# Altium schematic sheet Piezo.SchDoc
size A4; SheetNumber: 4; SheetTotal: 4
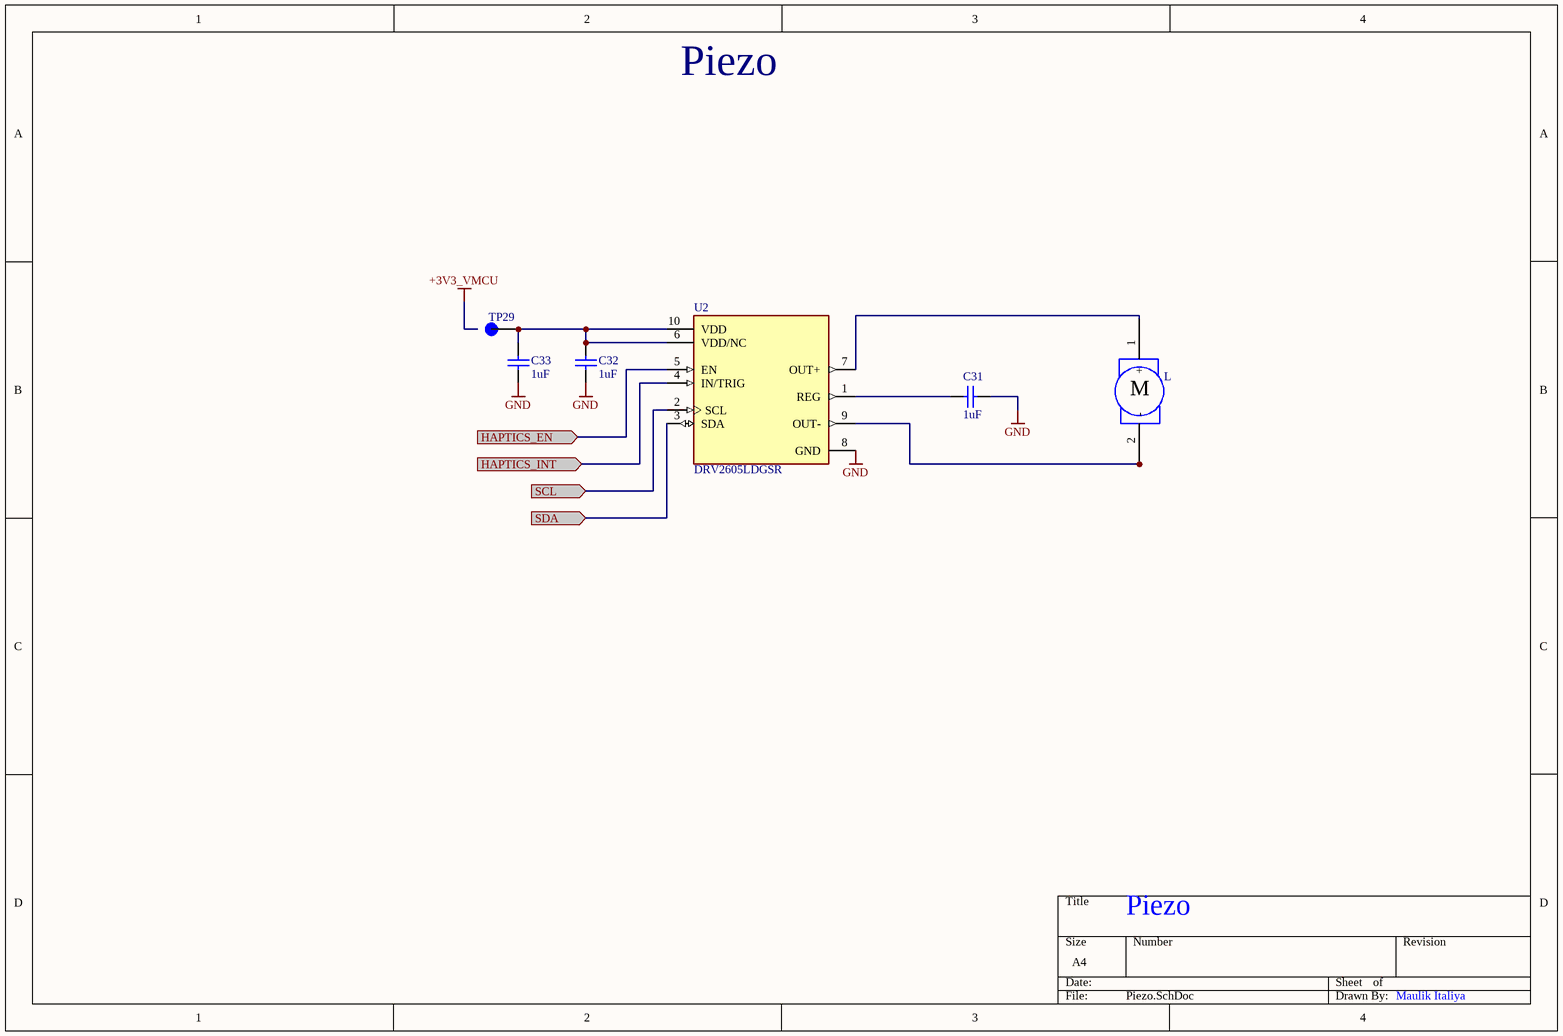
[diagram p0: Piezo.SchDoc]

## Parts
?  L
C31  value 1uF  (hidden comment: Capacitor)
C32  value 1uF  (hidden comment: Capacitor)
C33  value 1uF  (hidden comment: Capacitor)
TP29  (no value)  [KEYSTONE_5003]
U2  DRV2605LDGSR  [SOP50P490X110-10N]

## Ports
HAPTICS_EN (in, see MCU[2B]), HAPTICS_INT (in, see MCU[2B]), SCL (in, see MCU[2B]), SDA (in, see MCU[2B])

## Nets
GND: C31.2 C32.1 C33.1 U2.8(GND)
HAPTICS_EN: U2.5(EN) ; port HAPTICS_EN
HAPTICS_INT: U2.4(IN/TRIG) ; port HAPTICS_INT
SCL: U2.2(SCL) ; port SCL
SDA: U2.3(SDA) ; port SDA
Net?_1: ?.1(+) U2.7(OUT+)
Net?_2: ?.2(-) U2.9(OUT-)
NetC31_1: C31.1 U2.1(REG)
NetC32_2: C32.2 C33.2 TP29.TP U2.6(VDD/NC) U2.10(VDD)

## Notes on the sheet
- Piezo
- Maulik Italiya
- (in symbol L) M

## Library data of the parts
C31-C33 = Capacitor: SimulationGenericComponent: True
TP29 = 5003: Test Point Miniature THM H .300 Nylon 46 Insulated Orange PhosBronze/Silver | Keystone Electronics 5003; MF: Keystone Electronics Corp.; SnapEDA_Link: https://www.snapeda.com/parts/5003/Keystone/view-part/?ref=snap; Package: None; Value: *; MP: 5003; Check_prices: https://www.snapeda.com/parts/5003/Keystone/view-part/?ref=eda
U2 = DRV2605LDGSR: Haptic driver for ERM/LRA with 2-V operation, waveform library & auto-resonance tracking; MF: Texas Instruments; SnapEDA_Link: https://www.snapeda.com/parts/DRV2605LDGSR/Texas+Instruments/view-part/?ref=snap; Package: VSSOP-10 Texas Instruments; Value: *; MP: DRV2605LDGSR; Check_prices: https://www.snapeda.com/parts/DRV2605LDGSR/Texas+Instruments/view-part/?ref=eda